# EAGLE schematic cpu2 (EAGLE 5.00)
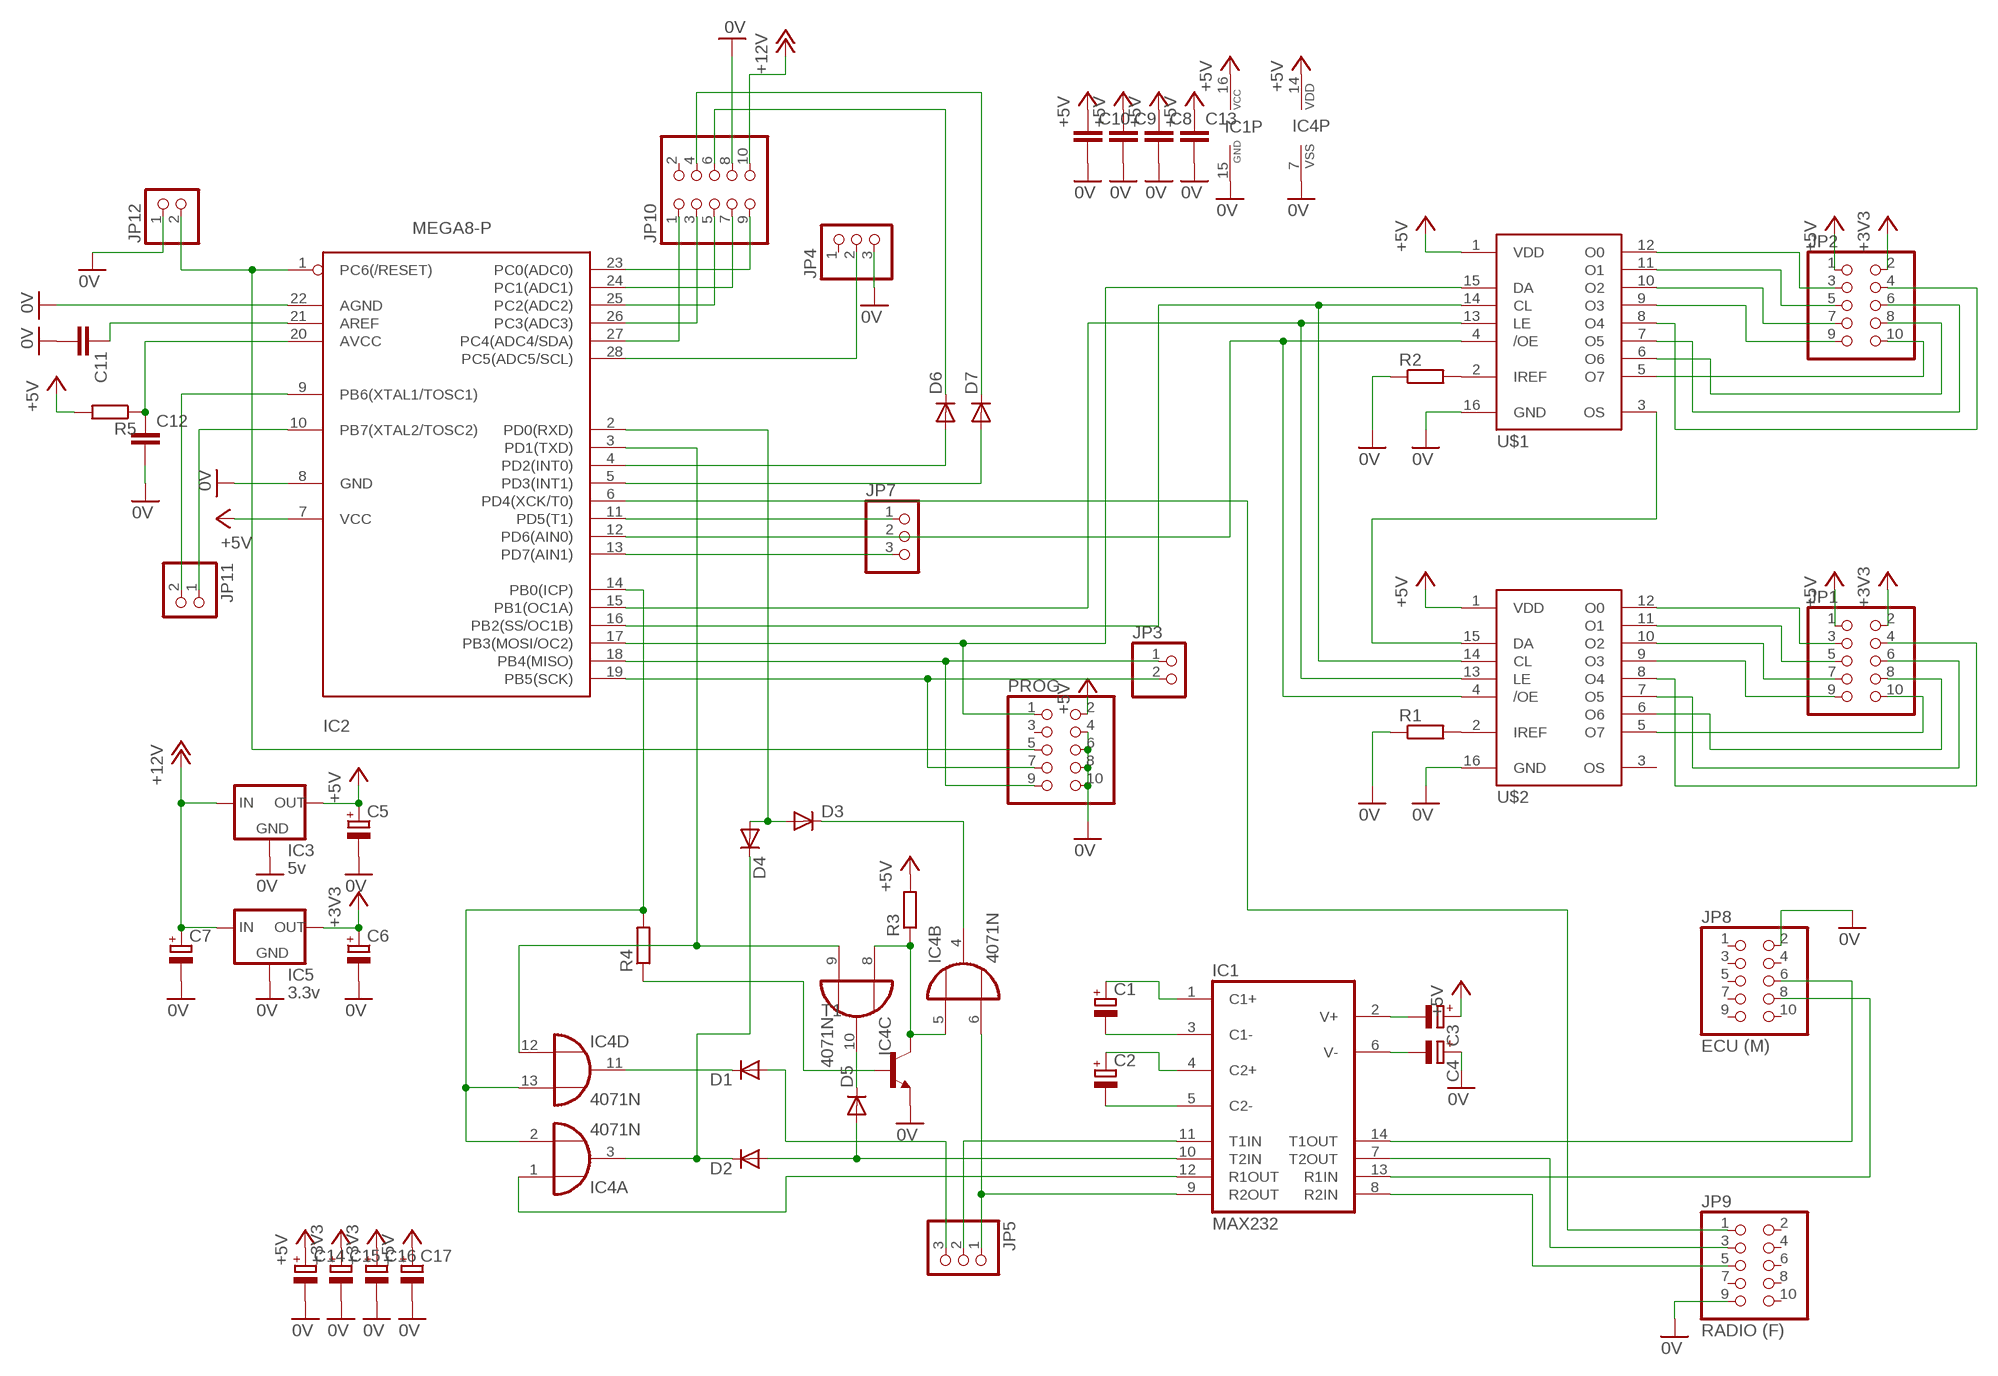
[diagram p0: schematic, sheet 1]

## Parts
C1  CPOL-EUE2.5-5  [E2,5-5]
C2  CPOL-EUE2.5-5  [E2,5-5]
C3  CPOL-EUE2.5-5  [E2,5-5]
C4  CPOL-EUE2.5-5  [E2,5-5]
C5  CPOL-EUE2.5-5  [E2,5-5]
C6  CPOL-EUE2.5-5  [E2,5-5]
C7  CPOL-EUE2.5-5  [E2,5-5]
C8  C-EU025-025X050  [C025-025X050]
C9  C-EU025-025X050  [C025-025X050]
C10  C-EU025-025X050  [C025-025X050]
C11  C-EU025-025X050  [C025-025X050]
C12  C-EU025-025X050  [C025-025X050]
C13  C-EU025-025X050  [C025-025X050]
C14  CPOL-EUE2.5-5  [E2,5-5]
C15  CPOL-EUE2.5-5  [E2,5-5]
C16  CPOL-EUE2.5-5  [E2,5-5]
C17  CPOL-EUE2.5-5  [E2,5-5]
D1  DIODE-D-7.5  [D-7.5]
D2  DIODE-D-7.5  [D-7.5]
D3  DIODE-D-7.5  [D-7.5]
D4  DIODE-D-7.5  [D-7.5]
D5  DIODE-D-7.5  [D-7.5]
D6  DIODE-D-7.5  [D-7.5]
D7  DIODE-D-7.5  [D-7.5]
IC1  MAX232  [DIL16]
IC2  MEGA8-P  [DIL28-3]
IC3  5v  78XXL  [78XXL]
IC4  4071N  [DIL14]
IC5  3.3v  78XXL  [78XXL]
JP1  PINHD-2X5  [2X05]
JP2  PINHD-2X5  [2X05]
JP3  PINHD-1X2  [1X02]
JP4  PINHD-1X3  [1X03]
JP5  PINHD-1X3  [1X03]
JP7  PINHD-1X3  [1X03]
JP8  ECU (M)  PINHD-2X5  [2X05]
JP9  RADIO (F)  PINHD-2X5  [2X05]
JP10  PINHD-2X5  [2X05]
JP11  PINHD-1X2  [1X02]
JP12  PINHD-1X2  [1X02]
PROG  PINHD-2X5  [2X05]
R1  R-EU_0204/7  [0204/7]
R2  R-EU_0204/7  [0204/7]
R3  R-EU_0204/7  [0204/7]
R4  R-EU_0204/7  [0204/7]
R5  R-EU_0204/7  [0204/7]
T1  BC547A-NPN-TO92-EBC  [TO92-EBC]
U$1  A6275BOTTOM  [WSOIC16-INV]
U$2  A6275BOTTOM  [WSOIC16-INV]

## Nets
0V: C4.+ C5.- C6.- C7.- C8.2 C9.2 C10.2 C11.2 C12.2 C13.2 C14.- C15.- C16.- C17.- IC1.15(GND) IC2.8(GND) IC2.22(AGND) IC3.GND IC4.7(P:VSS) IC5.GND JP4.3 JP8.2 JP9.9 JP10.8 JP12.1 PROG.4 PROG.6 PROG.8 PROG.10 R1.1 R2.1 T1.E U$1.16(GND) U$2.16(GND)
+3V3: C6.+ C15.+ C16.+ IC5.OUT JP1.2 JP2.2
+5V: C3.+ C5.+ C8.1 C9.1 C10.1 C13.1 C14.+ C17.+ IC1.16(VCC) IC2.7(VCC) IC3.OUT IC4.14(P:VDD) JP1.1 JP2.1 PROG.2 R3.2 R5.2 U$1.1(VDD) U$2.1(VDD)
+12V: C7.+ IC3.IN IC5.IN JP10.10
N$1: C2.- IC1.5(C2-)
N$2: C2.+ IC1.4(C2+)
N$3: C1.- IC1.3(C1-)
N$4: C1.+ IC1.1(C1+)
N$5: U$1.3(OS) U$2.15(DA)
N$6: IC2.17(PB3(MOSI/OC2)) PROG.1 U$1.15(DA)
N$7: IC2.16(PB2(SS/OC1B)) U$1.14(CL) U$2.14(CL)
N$8: IC2.15(PB1(OC1A)) U$1.13(LE) U$2.13(LE)
N$9: IC2.12(PD6(AIN0)) JP7.2 U$1.4(/OE) U$2.4(/OE)
N$10: R1.2 U$2.2(IREF)
N$11: R2.2 U$1.2(IREF)
N$12: C3.- IC1.2(V+)
N$13: C4.- IC1.6(V-)
N$14: D3.A D4.A IC2.2(PD0(RXD))
N$15: IC2.3(PD1(TXD)) IC4.9(C:I1) IC4.12(D:I0)
N$16: D2.A D5.A IC1.10(T2IN)
N$17: D2.C D4.C IC4.3(A:O)
N$18: D1.A JP5.3
N$19: D1.C IC4.11(D:O)
N$20: IC1.12(R1OUT) IC4.1(A:I0)
N$21: IC2.14(PB0(ICP)) IC4.2(A:I1) IC4.13(D:I1) R4.2
N$22: IC1.11(T1IN) JP5.2
N$23: IC1.9(R2OUT) IC4.6(B:I1) JP5.1
N$24: IC1.14(T1OUT) JP8.6
N$25: IC2.18(PB4(MISO)) JP3.1 PROG.9
N$26: D3.C IC4.4(B:O)
N$27: IC2.19(PB5(SCK)) JP3.2 PROG.7
N$28: D5.C IC4.10(C:O)
N$29: IC4.5(B:I0) IC4.8(C:I0) R3.1 T1.C
N$30: IC2.1(PC6(/RESET)) JP12.2 PROG.5
N$31: IC1.13(R1IN) JP8.8
N$32: IC1.7(T2OUT) JP9.3
N$33: JP2.3 U$1.12(O0)
N$34: JP2.5 U$1.11(O1)
N$35: JP2.7 U$1.10(O2)
N$36: JP2.9 U$1.9(O3)
N$37: JP2.4 U$1.8(O4)
N$38: JP2.6 U$1.7(O5)
N$39: C11.1 IC2.21(AREF)
N$40: C12.1 IC2.20(AVCC) R5.1
N$41: JP1.9 U$2.9(O3)
N$42: JP1.7 U$2.10(O2)
N$43: JP1.5 U$2.11(O1)
N$44: JP1.3 U$2.12(O0)
N$45: JP1.10 U$2.5(O7)
N$46: JP1.8 U$2.6(O6)
N$47: JP1.6 U$2.7(O5)
N$48: JP1.4 U$2.8(O4)
N$49: IC2.24(PC1(ADC1)) JP10.7
N$50: IC2.27(PC4(ADC4/SDA)) JP10.1
N$51: IC2.26(PC3(ADC3)) JP10.3
N$52: IC2.25(PC2(ADC2)) JP10.5
N$53: IC2.23(PC0(ADC0)) JP10.9
N$54: D6.C JP10.6
N$55: D6.A IC2.4(PD2(INT0))
N$56: D7.A IC2.5(PD3(INT1))
N$57: IC2.6(PD4(XCK/T0)) JP9.1
N$58: IC2.11(PD5(T1)) JP7.1
N$59: IC2.9(PB6(XTAL1/TOSC1)) JP11.2
N$60: IC2.13(PD7(AIN1)) JP7.3
N$61: R4.1 T1.B
N$62: IC1.8(R2IN) JP9.5
N$63: JP2.10 U$1.5(O7)
N$64: JP2.8 U$1.6(O6)
N$65: IC2.10(PB7(XTAL2/TOSC2)) JP11.1
N$151: D7.C JP10.4
N$152: IC2.28(PC5(ADC5/SCL)) JP4.2
Unconnected: JP4.1 JP8.1 JP8.3 JP8.4 JP8.5 JP8.7 JP8.9 JP8.10 JP9.2 JP9.4 JP9.6 JP9.7 JP9.8 JP9.10 JP10.2 PROG.3 U$2.3(OS)

## Library data of the parts
C1-C7 C14-C17 = rcl:CPOL-EU: POLARIZED CAPACITOR, European symbol
C8-C13 = rcl:C-EU: CAPACITOR, European symbol
D1-D7 = diode:DIODE-: DIODE
IC1 = maxim:MAX232: RS232 TRANSEIVER
IC2 = atmel:MEGA8-P: MICROCONTROLLER 8 Kbytes FLASH, 1 kbytes SRAM, 512 bytes EEPROM, USART, 4-channel 10 bit ADC, 2-channel 8 bit ADC Pin compatible with Atmega48, ATMega88, ATMega168 Source: avr.lbr
IC3 IC5 = v-reg:78XXL: VOLTAGE REGULATOR
IC4 = 40xx:4071: Quad 2-input OR
JP1 JP2 JP8-JP10 PROG = pinhead:PINHD-2X5: PIN HEADER
JP3 JP11 JP12 = pinhead:PINHD-1X2: PIN HEADER
JP4 JP5 JP7 = pinhead:PINHD-1X3: PIN HEADER
R1-R5 = rcl:R-EU_: RESISTOR, European symbol
T1 = transistor:*-NPN-: NPN Transistror BF959 corrected 2008.03.06
U$1 U$2 = rnie04:A6275